# EAGLE design Adafruit PiTFT 2.4in HAT (EAGLE 6.4)
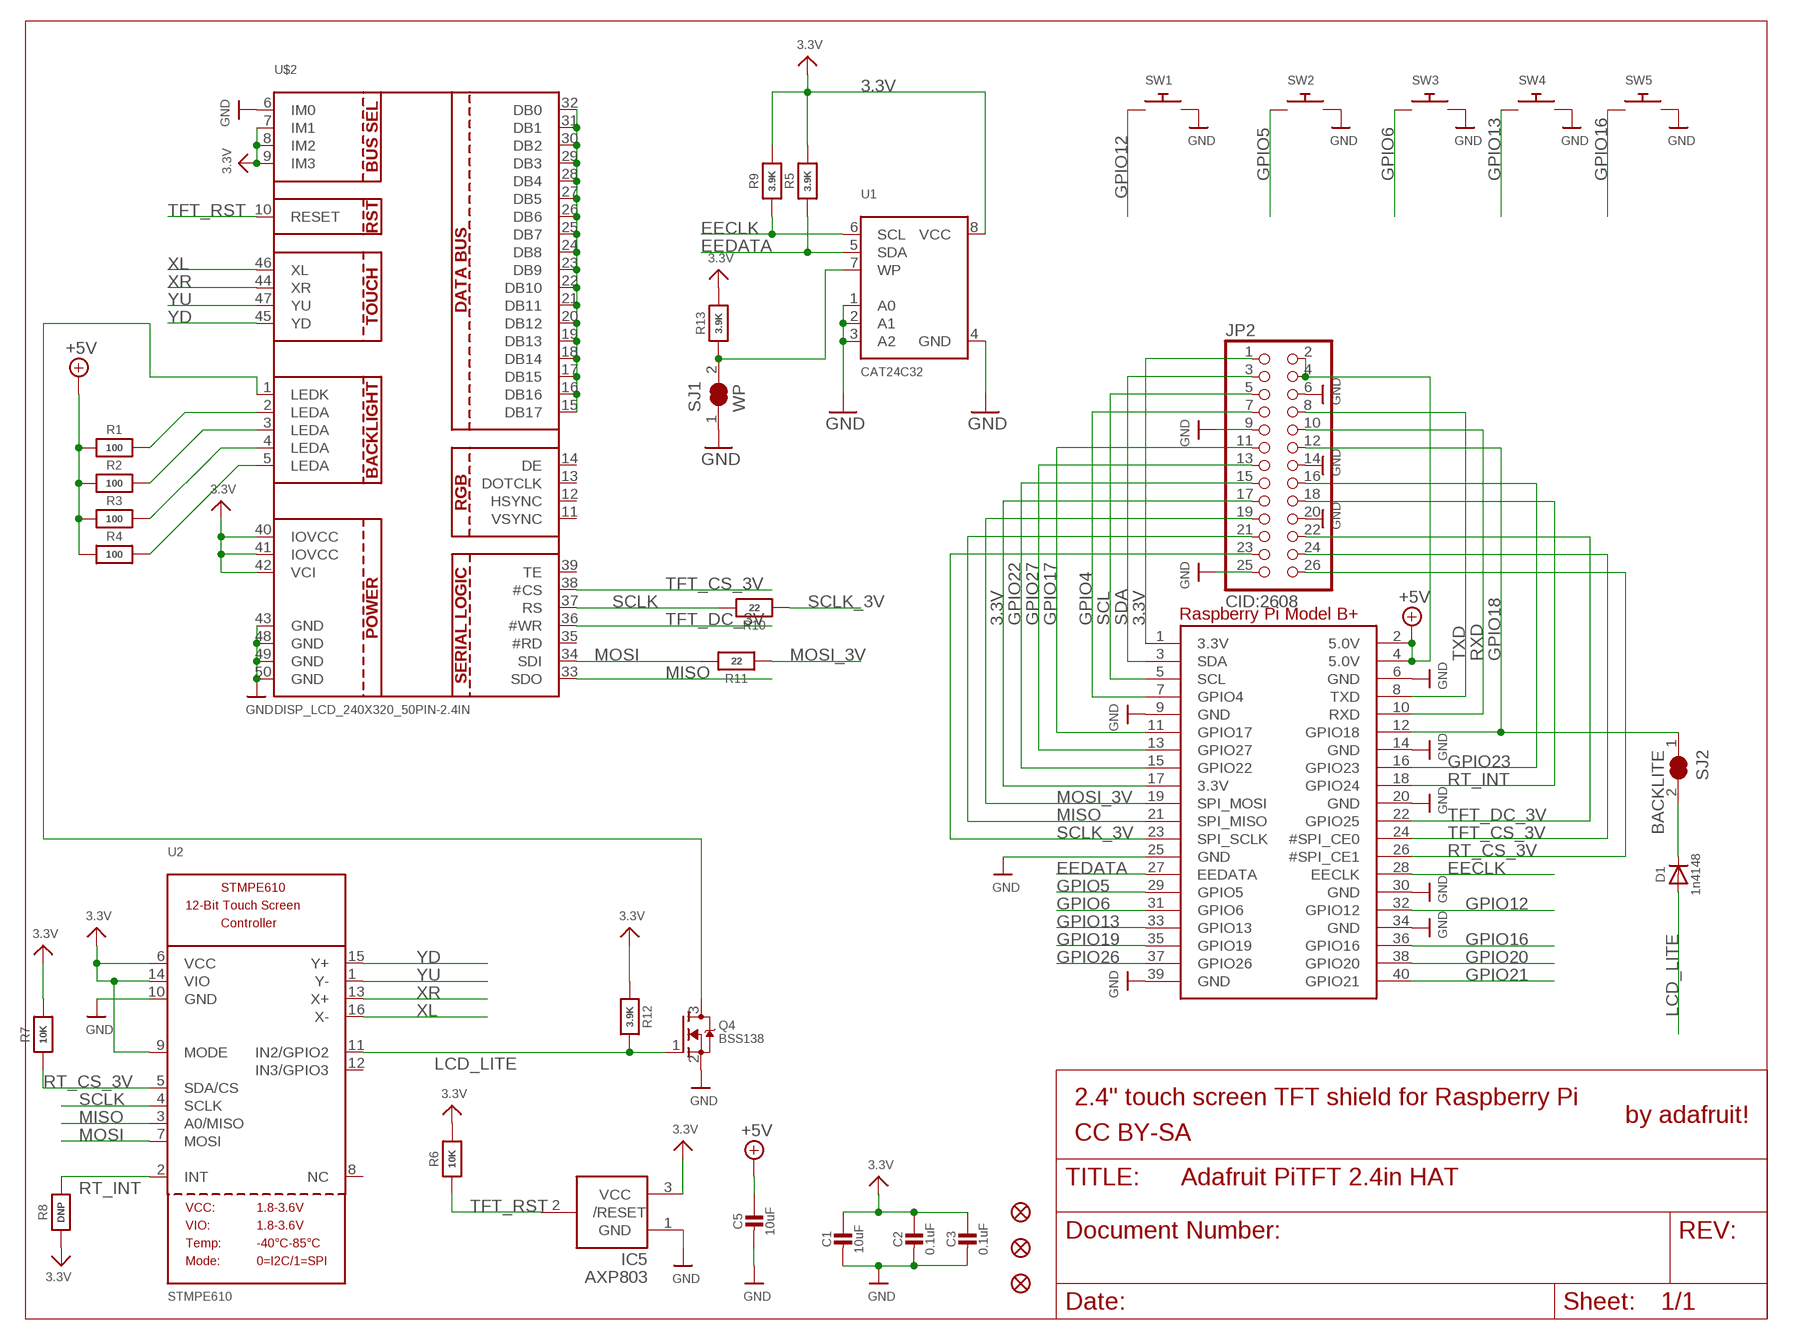
[diagram p0: schematic, sheet 1]

## Parts
C1  10uF  CAP_CERAMIC0805-NOOUTLINE  [0805-NO]
C2  0.1uF  CAP_CERAMIC0805-NOOUTLINE  [0805-NO]
C3  0.1uF  CAP_CERAMIC0805-NOOUTLINE  [0805-NO]
C5  10uF  CAP_CERAMIC0805-NOOUTLINE  [0805-NO]
D1  1n4148  DIODESOD-323  [SOD-323]
IC5  AXP803  AXP083-SAG  [SOT23]
JP2  CID:2608  HEADER-2X13-SMT  [2X13_SMT_MALE]
Q4  BSS138  MOSFET-NWIDE  [SOT23-WIDE]
R1  100  RESISTOR0805_NOOUTLINE  [0805-NO]
R2  100  RESISTOR0805_NOOUTLINE  [0805-NO]
R3  100  RESISTOR0805_NOOUTLINE  [0805-NO]
R4  100  RESISTOR0805_NOOUTLINE  [0805-NO]
R5  3.9K  RESISTOR0805_NOOUTLINE  [0805-NO]
R6  10K  RESISTOR0805_NOOUTLINE  [0805-NO]
R7  10K  RESISTOR0805_NOOUTLINE  [0805-NO]
R8  DNP  RESISTOR0805_NOOUTLINE  [0805-NO]
R9  3.9K  RESISTOR0805_NOOUTLINE  [0805-NO]
R10  22  RESISTOR0805_NOOUTLINE  [0805-NO]
R11  22  RESISTOR0805_NOOUTLINE  [0805-NO]
R12  3.9K  RESISTOR0805_NOOUTLINE  [0805-NO]
R13  3.9K  RESISTOR0805_NOOUTLINE  [0805-NO]
RPI1  RASPBERRYPI_BPLUS_HATNOSLOTS  [PI_HAT_NOSLOTS]
SJ1  WP  SOLDERJUMPER_CLOSED  [SOLDERJUMPER_CLOSEDWIRE]
SJ2  BACKLITE  SOLDERJUMPER_CLOSED  [SOLDERJUMPER_CLOSEDWIRE]
SW1  SWITCH_PUSHBUTTONEVQ-PE  [TACT_PANA-EVQ]
SW2  SWITCH_PUSHBUTTONEVQ-PE  [TACT_PANA-EVQ]
SW3  SWITCH_PUSHBUTTONEVQ-PE  [TACT_PANA-EVQ]
SW4  SWITCH_PUSHBUTTONEVQ-PE  [TACT_PANA-EVQ]
SW5  SWITCH_PUSHBUTTONEVQ-PE  [TACT_PANA-EVQ]
U1  CAT24C32  EEPROM_I2C_SOIC8_GENERIC  [SOIC8_150MIL]
U2  STMPE610  [QFN16_3MM]
U$2  DISP_LCD_240X320_50PIN-2.4IN  [TFT_2.4IN_240X320_50PIN]
U$10  FIDUCIAL""  [FIDUCIAL_1MM]
U$11  FIDUCIAL""  [FIDUCIAL_1MM]
U$18  FIDUCIAL""  [FIDUCIAL_1MM]

## Nets
3.3V: C1.1 C2.1 C3.1 IC5.3(VCC) JP2.1 JP2.17 R5.2 R6.2 R7.2 R8.1 R9.2 R12.1 R13.2 RPI1.1(3.3V) RPI1.17(3.3V) U1.8(VCC) U2.6(VCC) U2.9(MODE) U2.14(VIO) U$2.7(IM1) U$2.8(IM2) U$2.9(IM3) U$2.40(IOVCC) U$2.41(IOVCC) U$2.42(VCI)
+5V: C5.1 JP2.2 JP2.4 R1.1 R2.1 R3.1 R4.1 RPI1.2(5.0V) RPI1.4(5.0V)
EECLK: R9.1 RPI1.28(EECLK) U1.6(SCL)
EEDATA: R5.1 RPI1.27(EEDATA) U1.5(SDA)
GND: C1.2 C2.2 C3.2 C5.2 IC5.1(GND) JP2.6 JP2.9 JP2.14 JP2.20 JP2.25 Q4.2(S) RPI1.6(GND) RPI1.9(GND) RPI1.14(GND) RPI1.20(GND) RPI1.25(GND) RPI1.30(GND) RPI1.34(GND) RPI1.39(GND) SJ1.1 SW1.P$2 SW2.P$2 SW3.P$2 SW4.P$2 SW5.P$2 U1.1(A0) U1.2(A1) U1.3(A2) U1.4(GND) U2.10(GND) U$2.6(IM0) U$2.43(GND) U$2.48(GND) U$2.49(GND) U$2.50(GND)
GPIO4: JP2.7 RPI1.7(GPIO4)
GPIO5: RPI1.29(GPIO5) SW2.P$1
GPIO6: RPI1.31(GPIO6) SW3.P$1
GPIO12: RPI1.32(GPIO12) SW1.P$1
GPIO13: RPI1.33(GPIO13) SW4.P$1
GPIO16: RPI1.36(GPIO16) SW5.P$1
GPIO17: JP2.11 RPI1.11(GPIO17)
GPIO18: JP2.12 RPI1.12(GPIO18) SJ2.1
GPIO19: RPI1.35(GPIO19)
GPIO20: RPI1.38(GPIO20)
GPIO21: RPI1.40(GPIO21)
GPIO22: JP2.15 RPI1.15(GPIO22)
GPIO23: JP2.16 RPI1.16(GPIO23)
GPIO26: RPI1.37(GPIO26)
GPIO27: JP2.13 RPI1.13(GPIO27)
LCD_LITE: D1.A Q4.1(G) R12.2 U2.11(IN2/GPIO2)
MISO: JP2.21 RPI1.21(SPI_MISO) U2.3(A0/MISO) U$2.33(SDO)
MOSI: R11.2 U2.7(MOSI) U$2.34(SDI)
MOSI_3V: JP2.19 R11.1 RPI1.19(SPI_MOSI)
N$2: R1.2 U$2.2(LEDA)
N$3: R2.2 U$2.3(LEDA)
N$4: R3.2 U$2.4(LEDA)
N$5: Q4.3(D) U$2.1(LEDK)
N$8: D1.C SJ2.2
N$9: U$2.15(DB17) U$2.16(DB16) U$2.17(DB15) U$2.18(DB14) U$2.19(DB13) U$2.20(DB12) U$2.21(DB11) U$2.22(DB10) U$2.23(DB9) U$2.24(DB8) U$2.25(DB7) U$2.26(DB6) U$2.27(DB5) U$2.28(DB4) U$2.29(DB3) U$2.30(DB2) U$2.31(DB1) U$2.32(DB0)
N$10: R4.2 U$2.5(LEDA)
N$16: R13.1 SJ1.2 U1.7(WP)
RT_CS_3V: JP2.26 R7.1 RPI1.26(#SPI_CE1) U2.5(SDA/CS)
RT_INT: JP2.18 R8.2 RPI1.18(GPIO24) U2.2(INT)
RXD: JP2.10 RPI1.10(RXD)
SCL: JP2.5 RPI1.5(SCL)
SCLK: R10.2 U2.4(SCLK) U$2.37(RS)
SCLK_3V: JP2.23 R10.1 RPI1.23(SPI_SCLK)
SDA: JP2.3 RPI1.3(SDA)
TFT_CS_3V: JP2.24 RPI1.24(#SPI_CE0) U$2.38(#CS)
TFT_DC_3V: JP2.22 RPI1.22(GPIO25) U$2.36(#WR)
TFT_RST: IC5.2(/RESET) R6.1 U$2.10(RESET)
TXD: JP2.8 RPI1.8(TXD)
XL: U2.16(X-) U$2.46(XL)
XR: U2.13(X+) U$2.44(XR)
YD: U2.15(Y+) U$2.45(YD)
YU: U2.1(Y-) U$2.47(YU)
Unconnected: U2.8(NC) U2.12(IN3/GPIO3) U$2.11(VSYNC) U$2.12(HSYNC) U$2.13(DOTCLK) U$2.14(DE) U$2.35(#RD) U$2.39(TE)

## Notes on the sheet
- 2.4" touch screen TFT shield for Raspberry Pi
- by adafruit!
- CC BY-SA

## Library data of the parts
C1-C3 C5 = microbuilder:CAP_CERAMIC: Ceramic Capacitors For new designs, use the packages preceded by an '_' character since they are more reliable: The following footprints should be used on most boards: _0402 - Standard footprint for regular board layouts _0603 - Standard footprint for regular board layouts _0805 - Standard footprint for regular board layouts _1206 - Standard footprint for regular board layouts For extremely tight-pitch boards where space is at a premium, the following 'micro-pitch' footprints can be used (smaller pads, no silkscreen outline, etc.): _0402MP - Micro-pitch footprint for very dense/compact boards _0603MP - Micro-pitch footprint for very dense/compact boards _0805MP - Micro-pitch footprint for very dense/compact boards _1206MP - Micro-pitch footprint for very dense/compact boards
D1 = microbuilder:DIODE: Diode SMA Model Volts Amps Type Vf Ir Digikey # Notes SSA34-E3 40V 3A Schottky 480mV @ 3A 200uA @ 40V SSA34-E3/61TGITR-ND CDBA120-G 20V 1A Schottky 500mV @ 1A 500uA @ 20V 641-1014-6-ND REEL MBRA210 10V 2A Schottky 350mV @ 2A 700uA @ 10V MBRA210LT3 SOD-123 Model Volts Amps Type Vf Ir Order # Notes BAT54T1G 30V 200mA Schottky 800mV @ 200mA 2uA @ 25V BAT54T1GOSTR-ND B0530W 30V 500mA Schottky 430mV @ 500mA 130uA @ 30V B0530W-FDICT-ND REEL MBR120 20V 1A Schottky 340mV @ 1A MBR120VLSFT1GOSCT-ND SOD-323 Model Volts Amps Type Vf Ir Order # Notes PMEG2005EJ 20V 500mA Schottky 355mV @ 500mA 568-4110-1-ND ZLLS410 10V 570mA Schottky 380mV @ 570mA ZLLS410CT-ND 1N4148WS 75V 150mA Silicon/Simple 1V 1N4148WSFSCT-ND REEL SOD-523 Model Volts Amps Type Vf Ir Order # Notes BAT54XV2 30V 200mA Schottky 0.8V @ 100mA BAT54XV2CT-ND TB751S 30V 30mA Schottky RB751S-40TE61CT-ND SOT23-R/W (R = Solder Paste/Reflow Ovens, W = Hand-Soldering) Model Volts Amps Type Vf Ir Order # Notes BAT54FILM 40V 300mA Schottky 497-7162-1-ND POWERDI-5 Model Volts Amps Type Vf Ir Order # Notes PDS560 60V 5A Schottky 670mV @ 5A 150uA @ 60V PDS560DICT-ND
IC5 = adafruit:AXP083
JP2 = microbuilder:HEADER-2X13
Q4 = microbuilder:MOSFET-N: N-Channel Mosfet LEGEND VDS: Voltage Drain-Source ID: Drain Current RDS(ON): Drain-Source On-State Resistance VGS(TH): Gate-Source Threshold Voltage CISS: Drain-Source Input Capacitance SOT-23 Name VDS ID RDS(ON) VGS(TH) CISS Order Number 2N7002E 60V 260mA 2.5 Ohm 2.5V @ 250uA 26.7pF @ 25V 2N7002ET1GOSTR-ND BSH103 30V 850mA 400 mOhm 400mV @ 1mA 83pF @ 24V BSH103,235-ND BSS138 60V 320mA 1.6 Ohm 1.5V @ 250uA 50pF @ 10V Mouser: 771-BSS138PW115 DMN2075U-7 20V 4.2A 38 mOhm 1V @ 250 uA 594.3pF @ 10V DMN2075U-7DICT-ND * BSS138 good choice for I2C level-shifting POWERPAK 1212-8 Name VDS ID RDS(ON) VGS(TH) CISS Order Number Si7308DN 60V 6A 58 mOhm 3V @ 250uA 665pF @ 15V SI7308DN-T1-E3CT-ND
R1-R13 = microbuilder:RESISTOR: Resistors For new designs, use the packages preceded by an '_' character since they are more reliable: The following footprints should be used on most boards: _0402 - Standard footprint for regular board layouts _0603 - Standard footprint for regular board layouts _0805 - Standard footprint for regular board layouts _1206 - Standard footprint for regular board layouts For extremely tight-pitch boards where space is at a premium, the following 'micro-pitch' footprints can be used (smaller pads, no silkscreen outline, etc.): _0402MP - Micro-pitch footprint for very dense/compact boards _0603MP - Micro-pitch footprint for very dense/compact boards _0805MP - Micro-pitch footprint for very dense/compact boards _1206MP - Micro-pitch footprint for very dense/compact boards
RPI1 = microbuilder:RASPBERRYPI_BPLUS
SJ1 SJ2 = microbuilder:SOLDERJUMPER_CLOSED: Solder Jumper - Closed These solder jumpers are closed by default CLOSEDWIRE - 10 mil trace between pads that can be cut and resoldered later CLOSEDPERM - 63 mil trace between pads for a permanent connection (used to 'bridge' two signals, a shameless hack for Eagle). Can double as a test point as well (no cream layer)
SW1-SW5 = microbuilder:SWITCH_PUSHBUTTON: Buttons SOFTTOUCHSMD_SJ - Soft touch temporary push button (Super Junk Akihabara) Compatible with SKPMANE010 [Mouser: 688-SKPMAN] C&K_KSS = Digikey: KSS221GLFS
U1 = microbuilder:EEPROM_I2C_SOIC8_GENERIC: Note: The same pinout is used for many I2C EEPROMs in SOIC8(150mil) from a variety of manufacturers and in various sizes. Examples: 16K (2K x 8 Bit) I2C EEPROM 1.7-5.5V, 400KHz, -40°C-85°C Digikey: CAT24C16WI-GT3CT-ND 256K (32K x 8 Bit) I2C EEPROM 1.7-5.5V, 400KHz, -40°C-85°C Digikey: 24AA256-I/SN-ND
U2 = microbuilder:STMPE610: STMPE610 - 12-Bit Touch Screen Controller
U$2 = microbuilder:DISP_LCD_240X320_50PIN
U$10 U$11 U$18 = microbuilder:FIDUCIAL: Fiducial Alignment Points Various fiducial points for machine vision alignment.; BOM: EXCLUDE

## Board
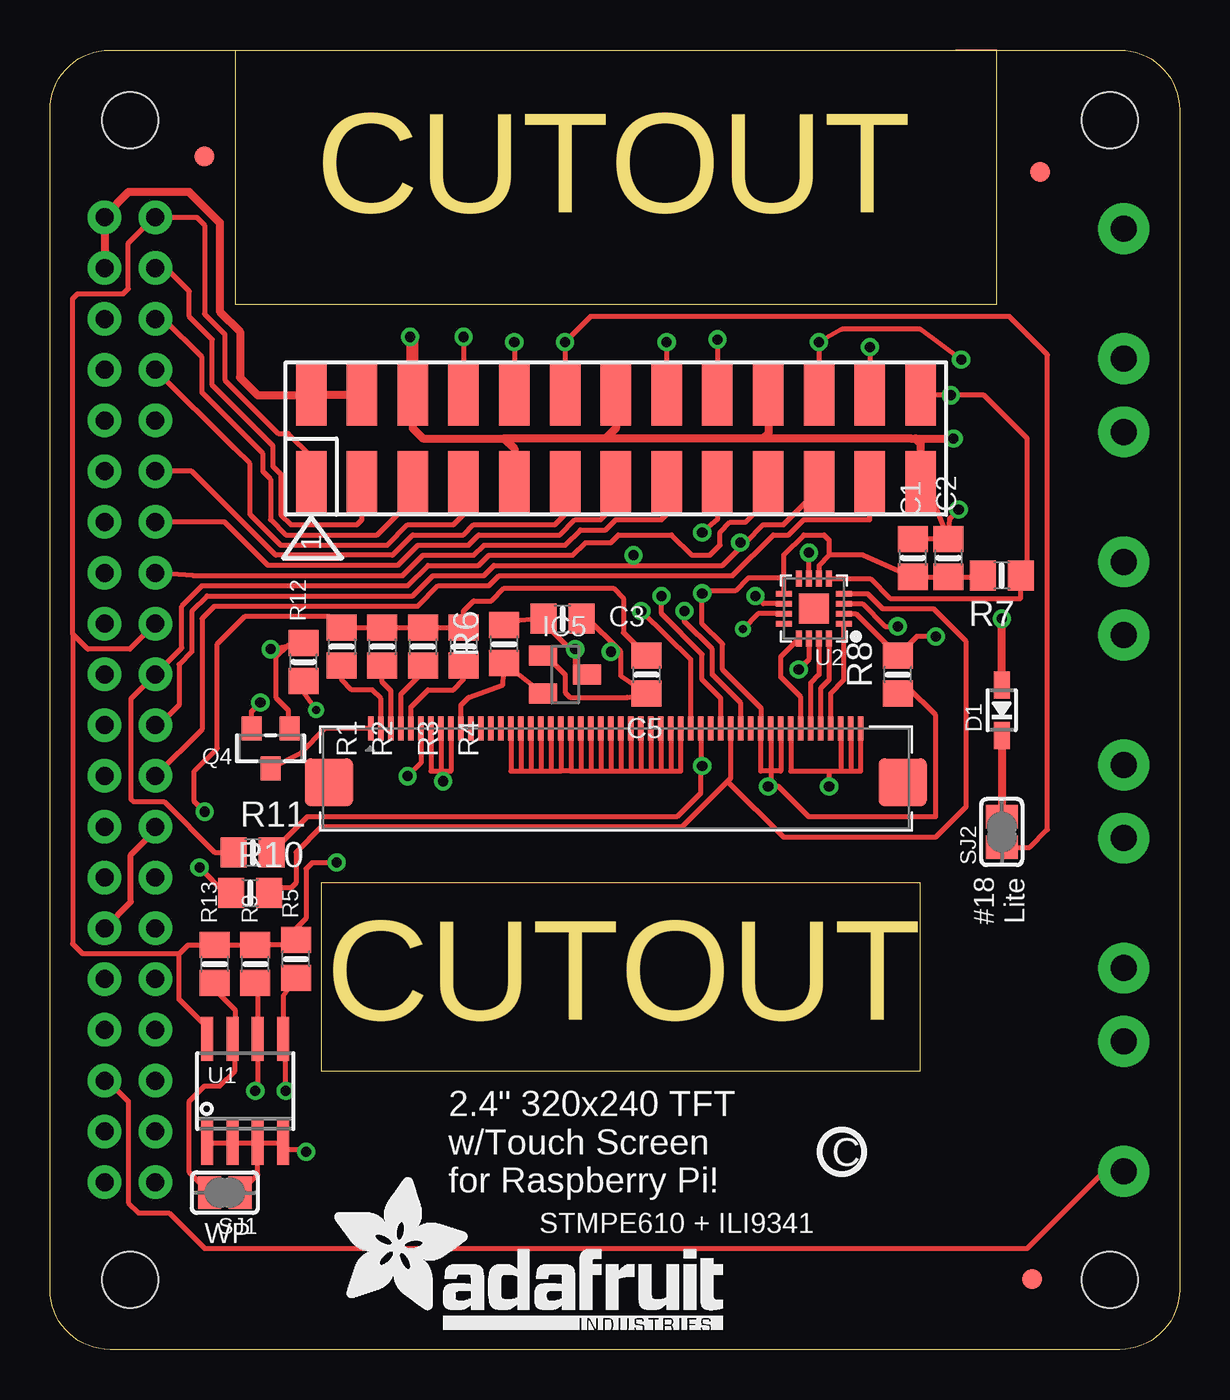
[diagram p1: board, top side]
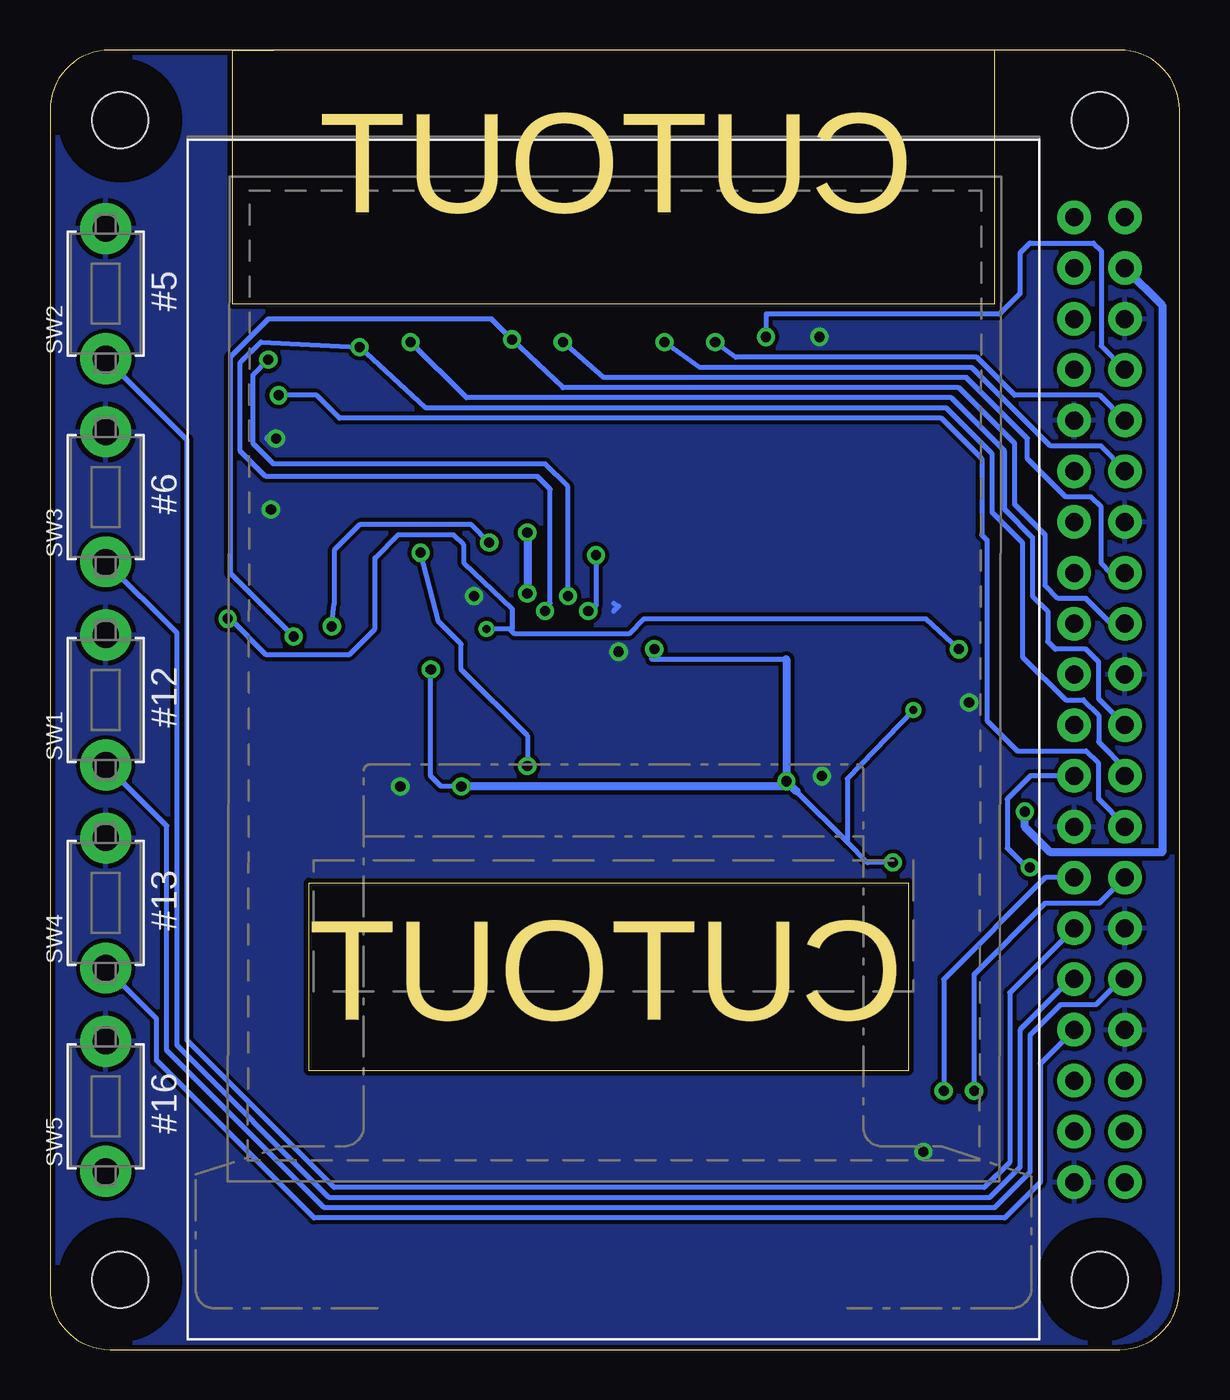
[diagram p2: board, bottom side, seen from below]

Size 56.5 x 65 mm. Coordinates in mm from the lower left corner, seen from the top.
Outline: 9.26,65 9.26,52.3 47.36,52.3 47.36,65 45.32,65
Outline: 43.55,23.34 13.57,23.34 13.57,13.95 43.55,13.95 43.55,23.34
Copper layers (1*16): Top 0.035mm / dielectric 1.5mm / Bottom 0.035mm
Design rules "adafruit *": minimum track width 8mil, minimum drill 15.5mil, track to track 8mil, track to pad 8mil, pad to pad 8mil, via to via 8mil, smd to smd 8mil, copper to edge 10mil, drill to drill 8mil, minimum pad ring 10mil, minimum via ring 8mil, stop-mask expansion 4mil, vias tented up to drill 20mil, thermal gap 10mil

### Footprints (pad centres in the part's own frame; a part is rotated, then mirrored left to right if it is on the bottom)
0805-NO = smd 1.3 x 1.5: 1 -0.95,0; 2 0.95,0
SOD-323 = smd 1.35 x 0.8: A 1.27,0; C -1.27,0
SOT23 = smd 1 x 1.4: 1 -0.95,-1.1; 2 0.95,-1.1; 3 0,1.1
2X13_SMT_MALE = smd 1.524 x 3.048: 1 -15.24,-2.159; 2 -15.24,2.159; 3 -12.7,-2.159; 4 -12.7,2.159; 5 -10.16,-2.159; 6 -10.16,2.159; 7 -7.62,-2.159; 8 -7.62,2.159; 9 -5.08,-2.159; 10 -5.08,2.159; 11 -2.54,-2.159; 12 -2.54,2.159; 13 0,-2.159; 14 0,2.159; 15 2.54,-2.159; 16 2.54,2.159; 17 5.08,-2.159; 18 5.08,2.159; 19 7.62,-2.159; 20 7.62,2.159; 21 10.16,-2.159; 22 10.16,2.159; 23 12.7,-2.159; 24 12.7,2.159; 25 15.24,-2.159; 26 15.24,2.159
SOT23-WIDE = smd 1 x 1.2: 1 -0.95,-1; 2 0.95,-1; 3 0,1
PI_HAT_NOSLOTS = drill 0.9 pad 1.676: 1 8.37,51.23; 2 8.37,53.77; 3 10.91,51.23; 4 10.91,53.77; 5 13.45,51.23; 6 13.45,53.77; 7 15.99,51.23; 8 15.99,53.77; 9 18.53,51.23; 10 18.53,53.77; 11 21.07,51.23; 12 21.07,53.77; 13 23.61,51.23; 14 23.61,53.77; 15 26.15,51.23; 16 26.15,53.77; 17 28.69,51.23; 18 28.69,53.77; 19 31.23,51.23; 20 31.23,53.77; 21 33.77,51.23; 22 33.77,53.77; 23 36.31,51.23; 24 36.31,53.77; 25 38.85,51.23; 26 38.85,53.77; 27 41.39,51.23; 28 41.39,53.77; 29 43.93,51.23; 30 43.93,53.77; 31 46.47,51.23; 32 46.47,53.77; 33 49.01,51.23; 34 49.01,53.77; 35 51.55,51.23; 36 51.55,53.77; 37 54.09,51.23; 38 54.09,53.77; 39 56.63,51.23; 40 56.63,53.77 | hole 2.8: 3.5,3.5; 3.5,52.5; 61.5,52.5; 61.5,3.5
SOLDERJUMPER_CLOSEDWIRE = smd 1.168 x 1.6: 1 -0.762,0; 2 0.762,0 | smd 0.635 x 0.203: WIRE 0,0
TACT_PANA-EVQ = drill 1.3 pad 2.54: P$1 -3.25,0; P$2 3.25,0
SOIC8_150MIL = smd 0.6 x 2.2: 1 -1.905,-2.6; 2 -0.635,-2.6; 3 0.635,-2.6; 4 1.905,-2.6; 5 1.905,2.6; 6 0.635,2.6; 7 -0.635,2.6; 8 -1.905,2.6
QFN16_3MM = smd 0.8 x 0.28: 1 -1.5,0.75; 2 -1.5,0.25; 3 -1.5,-0.25; 4 -1.5,-0.75; 9 1.5,-0.75; 10 1.5,-0.25; 11 1.5,0.25; 12 1.5,0.75 | smd 0.28 x 0.8: 5 -0.75,-1.5; 6 -0.25,-1.5; 7 0.25,-1.5; 8 0.75,-1.5; 13 0.75,1.5; 14 0.25,1.5; 15 -0.25,1.5; 16 -0.75,1.5 | smd 1.5 x 1.5: THERMAL 0,0
TFT_2.4IN_240X320_50PIN = smd 0.275 x 1.2 bottom: 1 12.25,28.551; 2 11.75,28.551; 3 11.25,28.551; 4 10.75,28.551; 5 10.25,28.551; 6 9.75,28.551; 7 9.25,28.551; 8 8.75,28.551; 9 8.25,28.551; 10 7.75,28.551; 11 7.25,28.551; 12 6.75,28.551; 13 6.25,28.551; 14 5.75,28.551; 15 5.25,28.551; 16 4.75,28.551; 17 4.25,28.551; 18 3.75,28.551; 19 3.25,28.551; 20 2.75,28.551; 21 2.25,28.551; 22 1.75,28.551; 23 1.25,28.551; 24 0.75,28.551; 25 0.25,28.551; 26 -0.25,28.551; 27 -0.75,28.551; 28 -1.25,28.551; 29 -1.75,28.551; 30 -2.25,28.551; 31 -2.75,28.551; 32 -3.25,28.551; 33 -3.75,28.551; 34 -4.25,28.551; 35 -4.75,28.551; 36 -5.25,28.551; 37 -5.75,28.551; 38 -6.25,28.551; 39 -6.75,28.551; 40 -7.25,28.551; 41 -7.75,28.551; 42 -8.25,28.551; 43 -8.75,28.551; 44 -9.25,28.551; 45 -9.75,28.551; 46 -10.25,28.551; 47 -10.75,28.551; 48 -11.25,28.551; 49 -11.75,28.551; 50 -12.25,28.551 | smd 2.4 x 2.4 bottom: PAD1 14.35,25.851; PAD2 -14.35,25.851
FIDUCIAL_1MM = smd 1 x 1: 1 0,0

### Placement (x,y rotation side)
C1  43.16,39.6 90 top
C2  44.94,39.6 90 top
C3  25.64,36.55 0 top
C5  29.83,33.76 270 top
D1  47.61,31.98 90 top
IC5  25.77,33.76 270 top
JP2  28.31,45.57 0 top
Q4  11.03,30.07 180 top
R1  14.59,35.16 270 top
R2  16.62,35.16 270 top
R3  18.65,35.16 270 top
R4  20.69,35.16 270 top
R5  12.3,19.53 90 top
R6  22.72,35.28 90 top
R7  47.61,38.71 180 top
R8  42.4,33.76 90 top
R9  10.27,19.28 90 top
R10  10.02,22.84 0 top
R11  10.14,24.87 0 top
R12  12.68,34.39 90 top
R13  8.24,19.28 90 top
RPI1  56.5,65 270 bottom
SJ1  8.75,7.85 180 top
SJ2  47.61,25.88 90 top
SW1  53.71,32.49 90 bottom
SW2  53.71,52.81 90 bottom
SW3  53.71,42.65 90 bottom
SW4  53.71,22.33 90 bottom
SW5  53.71,12.17 90 bottom
U1  9.76,12.93 0 top
U2  38.21,37.06 180 top
U$2  28.31,2.52 0 bottom
U$9  [PCBFEAT-REV-056]  39.61,9.88 0 top
U$10  7.73,59.67 180 top
U$11  49.13,3.53 270 top
U$18  49.52,58.9 90 top
U$23  [ADAFRUIT_TEXT_20MM]  14.08,0.99 0 top

### Tracks (layer width: path | path; a pad name or v marks a point on that pad's centre or on a via)
3.3V  (via drill 0.39, 0.5)
  Top 0.254: U$2.7 19.06,28.93 19.56,28.93 | 19.56,28.93 20.06,28.93 U$2.9 | U$2.8 19.56,28.93 | U$2.41 36.06,28.93 | 36.06,28.93 35.56,28.93 U$2.40 35.56,32.1 33.64,34.01 33.64,35.28 32.62,36.3 v32.62,37.82 | U$2.42 36.56,28.93 36.06,28.93 | U1.8 7.86,16.11 6.46,17.5 6.46,19.79 | 6.46,19.79 6.9,20.23 R13.2 R9.2 12.05,20.23 R5.2 12.3,21.06 12.81,21.57 12.81,24.04 13.13,24.36 v14.34,24.36 | U2.14 37.96,34.52 v37.45,34.01 | 36.06,28.93 36.06,28.3 v35.93,28.17 36.43,28.17 37.96,26.65 44.31,26.65 44.31,31.73 42.91,33.12 42.91,33.32 R8.1 | v19.67,28.42 19.56,28.54 19.56,28.93 | RPI1.17 3.99,35.03 1.89,35.03 1.13,35.79 | 1.13,35.79 1.13,52.55 1.38,52.81 3.67,52.81 3.92,53.06 3.92,55.35 5.2,56.63 RPI1.1 7.34,56.63 7.73,56.24 7.73,51.79 8.75,50.78 8.75,48.49 11.41,45.82 11.92,45.82 13.07,44.68 JP2.1 | 1.13,35.79 1.13,20.3 1.64,19.79 6.46,19.79 | C2.1 C1.1 40.69,39.73 38.97,39.73 | C2.1 44.82,39.15 | JP2.17 33.39,41.51 v32.62,40.87 | R12.1 12.68,32.87 v13.32,31.98 | 32.71,37.91 v32.62,37.82 | R6.2 22.91,36.42 C3.1 24.69,36.36 26.15,34.9 | 26.15,34.9 26.27,34.77 26.27,34.35 IC5.3 | v26.27,35.03 26.15,34.9 | 38.97,39.73 38.47,39.22 U2.6 | 38.97,39.73 38.97,40.49 38.72,40.74 37.7,40.74 36.71,39.75 U2.9 36.71,38.58 34.91,38.58 34.27,37.95 32.75,37.95 v32.62,37.82 | C2.1 46.6,38.65 R7.2
  Top 0.406: 12.94,43.41 JP2.1
  Bottom 0.254: 37.45,34.27 v37.45,34.01 37.45,28.68 36.94,28.17 v35.93,28.17 | v14.34,24.36 15.61,24.36 16.62,25.38 | 16.62,25.38 19.16,27.92 v19.67,28.42 | v13.32,31.98 16.62,28.55 16.62,25.38 | 19.67,34.52 26.4,34.52 v26.27,35.03
  Bottom 0.406: 19.67,34.52 v19.67,28.42 | 19.16,27.92 19.42,28.17 v35.93,28.17 | v32.62,40.87 v32.62,37.82
+5V  (via drill 0.5)
  Top 0.254: v7.73,26.9 7.22,27.41 7.22,28.93 8.37,30.07 8.37,35.28 9.76,36.68 13.96,36.68 14.53,36.1 R1.1 | R1.1 R2.1 R3.1 | R3.1 R4.1 20.69,36.93 21.19,37.44 22.08,37.44 22.72,38.08 28.18,38.08 28.69,37.57 28.69,35.85 C5.1 | 14.21,36.04 14.59,35.66 R1.1 | 18.85,36.42 R3.1
  Top 0.406: JP2.4 JP2.2 10.4,47.73 9.51,48.62 9.51,50.9 8.49,51.92 8.49,56.36 6.97,57.89 3.92,57.89 2.73,56.7 RPI1.2 RPI1.4
  Bottom 0.406: RPI1.4 0.87,52.23 0.87,24.87 6.46,24.87 7.73,26.14 v7.73,26.9
EECLK  (via drill 0.5)
  Top 0.254: R9.1 10.4,18.2 U1.6 10.4,13.06 v10.27,12.93
  Bottom 0.254: v10.27,12.93 10.27,18.77 6.72,22.33 4.01,22.33 RPI1.28
EEDATA  (via drill 0.5)
  Top 0.254: R5.1 11.67,17.7 U1.5 11.8,15.4 v11.8,12.93
  Bottom 0.254: RPI1.27 6.7,23.61 11.8,18.52 v11.8,12.93 11.54,13.18
GND  (via drill 0.5)
  Top 0.254: 43.29,45.57 43.04,45.57 | U$2.43 37.06,28.93 38.97,28.93 | 38.97,28.93 39.56,28.93 | 39.56,28.93 40.06,28.93 | U$2.50 40.56,28.93 40.06,28.93 | U$2.49 40.06,28.93 | U$2.48 39.56,28.93 | U1.1 U1.2 U1.3 | U1.3 U1.4 11.67,10.01 12.68,10.01 v12.81,9.88 | SJ1.1 10.4,8.74 U1.3 | 38.97,28.93 v38.97,28.17 | U$2.6 18.56,29.34 v17.89,28.68 | C2.2 C1.2 | C2.2 45.01,41.57 v45.45,42.01 | Q4.2 10.08,31.92 v10.53,32.36 | IC5.1 24.82,34.71 25.77,33.76 25.77,32.87 26.02,32.62 28.88,32.62 C5.2 28.56,33.7 28.56,34.9 28.31,35.16 | 26.59,36.11 C3.2 27.04,36.42 28.31,35.16 | v28.05,34.9 28.31,35.16 | U2.10 35.68,37.31 v35.29,37.7 | JP2.25 43.93,43.03 C2.2
  Top 0.305: RPI1.30 4.05,22.39 4.05,24.74 5.27,25.96 RPI1.25
  Top 0.406: JP2.6 18.15,46.08 18.65,45.57 22.72,45.57 | 22.72,45.57 23.23,45.06 JP2.9 | JP2.14 28.31,46.08 27.8,45.57 | 27.8,45.57 22.72,45.57 | JP2.20 35.93,45.82 35.67,45.57 | 35.67,45.57 27.8,45.57 | JP2.25 43.55,45.31 43.29,45.57 | 35.67,45.57 43.04,45.57 v45.2,45.57
  Top 0.61: JP2.6 18.15,50.52 v18.02,50.65
  Bottom 0.254: v38.97,28.17 38.97,27.92 | v17.89,28.68 17.64,28.93 | 28.31,37.31 28.05,37.19 28.31,36.93
  Bottom 0.406: v45.2,45.57 45.58,45.57
  pour Bottom: -0.14,66.02 -0.14,-0.02 56.5,-0.02 56.5,66.02
GPIO4
  Top 0.254: JP2.7 20.69,41.76 20.18,41.25 17.89,41.25 16.88,40.23 11.54,40.23 10.01,41.77 10.01,44.31 9.24,45.07 RPI1.7
GPIO5
  Bottom 0.254: RPI1.29 8.49,17.85 8.49,9.37 9.76,8.1 42.28,8.1 49.64,15.47 49.64,45.49 SW2.P$1
GPIO6
  Bottom 0.254: RPI1.31 5.43,18.53 7.99,15.98 7.99,9.12 9.51,7.6 42.53,7.6 50.15,15.22 50.15,35.84 SW3.P$1
GPIO12
  Bottom 0.254: RPI1.32 2.89,18.53 4.18,17.25 5.95,17.25 7.48,15.72 7.48,8.87 9.26,7.09 42.78,7.09 50.66,14.96 50.66,26.19 SW1.P$1
GPIO13
  Bottom 0.254: RPI1.33 6.97,14.29 6.97,8.36 8.75,6.58 43.29,6.58 51.17,14.45 51.17,16.54 SW4.P$1
GPIO16
  Top 0.254: SW5.P$1 52.74,8.92 48.88,5.06 7.73,5.06 5.95,6.83 4.43,6.83 3.92,7.34 3.92,12.42 2.89,13.45 RPI1.36
GPIO17
  Top 0.254: JP2.11 25.77,41.76 25.26,41.25 21.19,41.25 20.69,40.74 18.15,40.74 17.13,39.73 11.29,39.73 7.08,43.93 RPI1.11
GPIO18  (via drill 0.5)
  Top 0.254: JP2.12 v25.77,50.39 27.04,51.66 47.99,51.66 49.9,49.76 49.9,26.01 49.01,25.12 SJ2.1
  Bottom 0.254: RPI1.12 2.73,44 3.92,45.19 6.46,45.19 10.4,49.12 23.99,49.12 v25.77,50.39
GPIO22
  Top 0.254: JP2.15 30.85,41.76 30.59,41.51 28.31,41.51 27.8,41 26.53,41 25.77,40.23 21.7,40.23 21.19,39.73 18.65,39.73 17.64,38.71 7.16,38.71 RPI1.15
GPIO23  (via drill 0.5)
  Top 0.254: v30.85,50.39 JP2.16
  Bottom 0.254: RPI1.16 3.43,38.85 3.92,39.35 3.92,42.14 4.43,42.65 5.7,42.65 7.6,44.55 7.6,45.57 10.65,48.62 28.81,48.62 v30.85,50.39
GPIO27
  Top 0.254: JP2.13 28.31,42.27 27.54,41.51 26.27,41.51 25.51,40.74 21.45,40.74 20.94,40.23 18.4,40.23 17.38,39.22 10.91,39.22 8.74,41.39 RPI1.13
LCD_LITE  (via drill 0.39, 0.5)
  Top 0.254: U2.11 35.42,36.81 v34.66,36.04 | v11.03,35.03 R12.2 11.9,35.22 11.29,34.6 11.29,32.62 11.92,31.98 11.92,31.14 Q4.1
  Top 0.406: D1.A v47.61,36.55
  Bottom 0.254: 33.51,36.04 33.39,36.04 33.39,37.06 35.8,39.35 35.8,40.23 36.31,40.74 39.1,40.74 40.24,39.6 40.24,36.04 41.51,34.77 45.7,34.77 47.48,36.55 v47.61,36.55 | 33.51,36.04 v34.66,36.04 | v11.03,35.03 12.68,36.55 26.78,36.55 27.54,35.79 33.26,35.79 33.51,36.04
MISO  (via drill 0.5)
  Top 0.254: 29.2,39.22 22.21,39.22 21.7,38.71 19.16,38.71 18.15,37.7 7.86,37.7 7.1,36.93 7.1,34.9 6.46,34.27 6.46,32.23 5.46,31.23 RPI1.21 | 29.2,39.22 33.64,39.22 34.78,40.36 | 38.47,42.77 JP2.21 38.47,43.03 36.69,41.25 35.67,41.25 34.78,40.36 | U$2.33 32.06,34.52 v29.58,36.93 | U2.3 40.63,37.31 41.77,36.17 v42.4,36.17 | 29.2,39.22 v29.2,39.73 | 34.78,40.36 v34.53,40.36
  Bottom 0.254: v42.4,36.17 42.28,37.31 42.28,39.98 41.01,41.25 35.42,41.25 v34.53,40.36 | v29.2,39.73 29.2,37.19 v29.58,36.93
MOSI  (via drill 0.5)
  Top 0.254: U$2.34 32.56,29.25 v32.62,29.19 32.56,29.12 32.56,27.85 31.35,26.65 12.87,26.65 R11.2 | U2.7 v37.96,39.85
  Bottom 0.254: v32.62,29.19 32.62,30.71 35.93,34.01 35.93,35.28 37.07,36.42 v37.96,39.85
MOSI_3V
  Top 0.254: 35.93,42.27 35.93,42.52 | 35.93,42.52 JP2.19 | R11.1 8.24,24.87 5.7,27.41 4.18,27.41 4.05,27.54 4.05,32.55 RPI1.19 6.59,35.09 6.59,37.19 7.6,38.2 17.89,38.2 18.91,39.22 21.45,39.22 21.96,39.73 26.15,39.73 26.78,40.36 28.05,40.36 28.43,40.74 31.1,40.74 32.12,39.73 33.01,39.73 33.51,40.23 33.51,40.87 34.02,41.38 34.78,41.38 35.93,42.52
N$2
  Top 0.254: U$2.2 16.56,32.55 16.11,33 15.1,33 14.59,33.5 R1.2
N$3
  Top 0.254: U$2.3 17.06,32.94 16.62,33.38 R2.2
N$4
  Top 0.254: U$2.4 17.56,32.79 18.65,33.88 R3.2
N$5
  Top 0.254: U$2.1 13.76,31.07 12.57,29.84 Q4.3 11.03,29.06
N$8
  Top 0.406: D1.C SJ2.2
N$9
  Top 0.254: U$2.15 23.06,28.93 23.56,28.93 | 23.56,28.93 24.06,28.93 | 24.06,28.93 24.56,28.93 | 24.56,28.93 25.06,28.93 | 25.06,28.93 25.56,28.93 | 26.06,28.93 26.56,28.93 | 26.56,28.93 27.06,28.93 | 27.06,28.93 27.56,28.93 | 27.56,28.93 28.06,28.93 | 28.06,28.93 28.56,28.93 | 28.56,28.93 29.06,28.93 | 29.06,28.93 29.56,28.93 | 29.56,28.93 30.06,28.93 | 30.06,28.93 30.56,28.93 | 30.56,28.93 31.06,28.93 | 31.06,28.93 31.56,28.93 U$2.32 | U$2.16 23.56,28.93 | U$2.17 24.06,28.93 | U$2.18 24.56,28.93 | U$2.19 25.06,28.93 | U$2.20 25.56,28.93 | U$2.21 26.06,28.93 | 26.06,28.93 25.56,28.93 | U$2.22 26.56,28.93 | U$2.23 27.06,28.93 | U$2.24 27.56,28.93 | U$2.25 28.06,28.93 | U$2.26 28.56,28.93 | U$2.27 29.06,28.93 | U$2.28 29.56,28.93 | U$2.29 30.06,28.93 | U$2.30 30.56,28.93 | U$2.31 31.06,28.93
N$10
  Top 0.254: U$2.5 18.06,32.14 18.91,33 20.18,33 20.69,33.5 R4.2
N$16
  Top 0.254: R13.1 8.24,18.01 9.26,16.99 9.26,15.66 U1.7 9.26,15.4 9.26,13.95 8.49,13.18 7.73,13.18 6.97,12.42 6.97,8.87 SJ1.2
RT_CS_3V  (via drill 0.5)
  Top 0.254: v45.07,47.73 JP2.26 46.72,47.73 48.88,45.57 48.88,38.71 R7.1 48.56,37.57 42.02,37.57 41.03,38.56 U2.5
  Bottom 0.254: RPI1.26 2.73,26.22 4.05,27.54 4.05,29.31 4.68,29.95 8.11,29.95 9.64,31.47 9.64,40.49 9.89,40.74 9.89,44.55 11.92,46.59 42.02,46.59 43.16,47.73 v45.07,47.73
RT_INT  (via drill 0.5)
  Top 0.254: v33.39,50.52 JP2.18 | U2.2 40.3,36.81 R8.2 43.36,35.66 v44.31,35.66
  Bottom 0.254: RPI1.18 3.43,36.31 4.68,37.57 6.08,37.57 6.72,38.2 6.72,40.74 8.24,42.27 8.24,45.31 11.03,48.11 30.85,48.11 v33.39,50.52 34.4,51.54 45.58,51.54 47.48,49.63 47.48,38.84 v44.31,35.66
RXD  (via drill 0.5)
  Top 0.254: v23.23,50.39 JP2.10
  Bottom 0.254: RPI1.10 3.99,47.73 8.24,47.73 10.14,49.63 22.21,49.63 v23.23,50.39
SCL
  Top 0.254: JP2.5 18.15,42.52 16.37,40.74 11.8,40.74 11.03,41.51 11.03,43.54 10.65,43.92 10.65,44.81 7.6,47.85 7.6,49.63 5.69,51.55 RPI1.5
SCLK
  Top 0.254: 33.89,28.42 31.61,26.14 13.57,26.14 12.3,24.87 12.3,23.34 12.05,23.09 11.22,23.09 R10.2 | 33.89,28.42 34.06,28.59 U$2.37 | 33.89,28.42 36.69,25.63 44.31,25.63 45.83,27.15 45.83,35.41 44.18,37.06 41.64,37.06 40.89,37.81 U2.4
SCLK_3V  (via drill 0.5)
  Top 0.254: JP2.23 41.01,41.51 37.7,41.51 36.94,40.74 36.18,40.74 34.15,38.71 22.46,38.71 21.96,38.2 19.42,38.2 18.4,37.19 8.24,37.19 7.6,36.55 7.6,31.02 RPI1.23 | v7.48,24.11 8.75,22.84 R10.1
  Bottom 0.254: RPI1.23 7.47,28.69 8.62,27.54 8.62,25.09 7.64,24.11 v7.48,24.11
SDA
  Top 0.254: JP2.3 15.61,41.51 15.35,41.25 12.05,41.25 11.54,41.76 11.54,43.79 11.16,44.17 11.16,45.19 8.11,48.24 8.11,50.52 6.97,51.66 6.97,52.94 5.81,54.09 RPI1.3
TFT_CS_3V  (via drill 0.5)
  Top 0.254: v41.01,50.14 JP2.24 | U$2.38 34.56,32.33 33.13,33.76 33.13,35.03 31.73,36.42 v31.73,36.93
  Bottom 0.254: 2.65,28.68 2.65,28.99 4.05,30.39 4.05,31.73 4.81,32.49 5.7,32.49 7.86,34.65 7.86,40.36 9.38,41.89 9.38,44.81 11.67,47.09 37.7,47.09 v41.01,50.14 45.96,50.39 46.98,49.38 46.98,44.93 45.7,43.66 32.12,43.66 31.48,43.03 31.48,37.31 v31.73,36.93
  Bottom 0.305: 2.65,28.68 2.66,28.69 RPI1.24
TFT_DC_3V  (via drill 0.5)
  Top 0.254: JP2.22 v38.47,50.39 39.61,51.03 43.55,51.03 v45.58,49.51 | U$2.36 33.56,32.57 32.62,33.5 32.62,34.77 30.59,36.81 v30.59,37.7
  Bottom 0.254: RPI1.22 4.05,32.55 4.05,34.39 4.68,35.03 6.21,35.03 6.59,35.41 6.59,36.93 7.35,37.7 7.35,40.62 8.75,42.01 8.75,44.93 11.41,47.6 35.67,47.6 v38.47,50.39 | v30.59,37.7 30.59,43.16 31.73,44.3 45.32,44.3 46.34,45.31 46.34,48.74 v45.58,49.51
TFT_RST
  Top 0.254: U$2.10 20.56,32.23 20.94,32.62 22.65,33.25 R6.1 IC5.2
TXD  (via drill 0.5)
  Top 0.254: v20.69,50.65 JP2.8
  Bottom 0.254: RPI1.8 3.92,50.2 3.92,54.97 4.3,55.35 7.48,55.35 7.99,54.84 7.99,52.81 9,51.79 20.69,51.79 v20.69,50.65
XL
  Top 0.254: U$2.46 38.56,33.09 38.96,33.49 | 38.96,33.49 38.97,33.5 | U2.16 38.96,33.49
XR
  Top 0.254: U$2.44 37.56,32.64 36.56,33.63 36.56,34.66 U2.13
YD
  Top 0.254: U$2.45 38.06,33.35 38.47,33.76 38.46,33.76 U2.15
YU
  Top 0.254: U$2.47 39.06,32.82 39.71,33.48 U2.1

### Text on the board
Dimension: CUTOUT | CUTOUT
tPlace: 1 | #18 / Lite | 2.4" 320x240 TFT / w/Touch Screen / for Raspberry Pi! | WP | STMPE610 + ILI9341
bPlace: #5 | #6 | #12 | #13 | #16